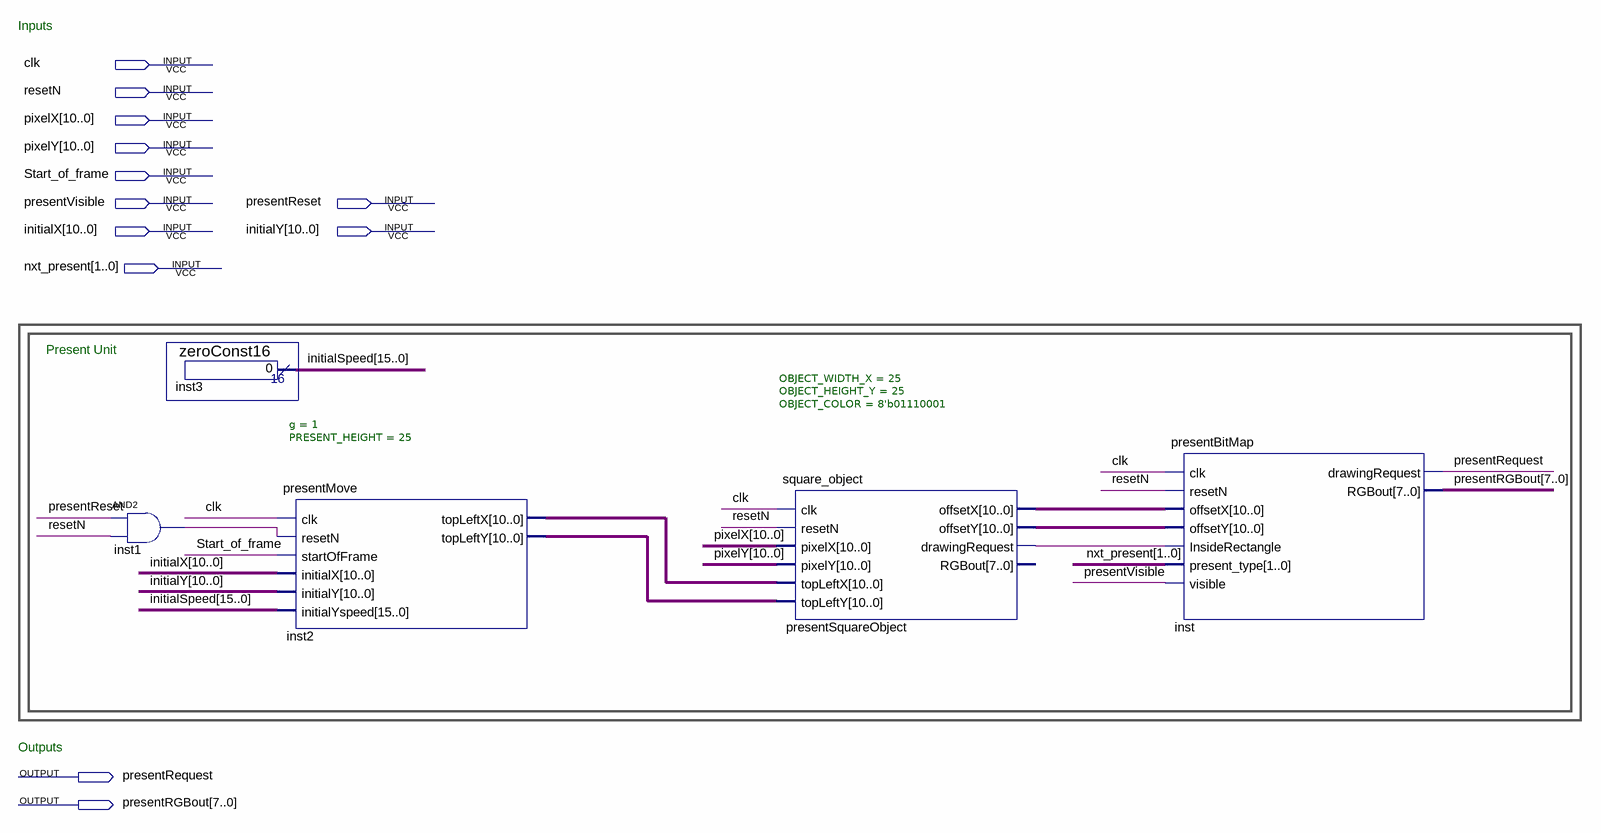
[diagram p0: schematic sheet]
// Quartus schematic present_top.bdf as structural Verilog: 5 symbols, 12 pins
module present_top (
  input  clk,
  input  resetN,
  input  [10:0] pixelX,
  input  [10:0] pixelY,
  input  Start_of_frame,
  input  presentVisible,
  input  presentReset,
  input  [10:0] initialX,
  input  [10:0] initialY,
  input  [1:0] nxt_present,
  output presentRequest,
  output [7:0] presentRGBout
);

  wire inst1_out, presentSquareObject_drawingrequest;
  wire [10:0] inst2_topleftx, inst2_toplefty, presentSquareObject_offsetx, presentSquareObject_offsety;
  wire [15:0] initialSpeed;

  and inst1 (inst1_out, presentReset, resetN);
  zeroConst16 inst3 (.result(initialSpeed));
  presentMove #(.g(1), .PRESENT_HEIGHT(25)) inst2 (
    .clk(clk), .resetN(inst1_out), .startOfFrame(Start_of_frame), .initialX(initialX), .initialY(initialY),
    .initialYspeed(initialSpeed), .topLeftX(inst2_topleftx), .topLeftY(inst2_toplefty));
  square_object #(.OBJECT_WIDTH_X(25), .OBJECT_HEIGHT_Y(25), .OBJECT_COLOR(8'b01110001)) presentSquareObject (
    .clk(clk), .resetN(resetN), .pixelX(pixelX), .pixelY(pixelY), .topLeftX(inst2_topleftx),
    .topLeftY(inst2_toplefty), .offsetX(presentSquareObject_offsetx), .offsetY(presentSquareObject_offsety),
    .drawingRequest(presentSquareObject_drawingrequest));  // open: RGBout
  presentBitMap inst (
    .clk(clk), .resetN(resetN), .offsetX(presentSquareObject_offsetx), .offsetY(presentSquareObject_offsety),
    .InsideRectangle(presentSquareObject_drawingrequest), .present_type(nxt_present),
    .visible(presentVisible), .drawingRequest(presentRequest), .RGBout(presentRGBout));

  // Notes on the sheet:
  //   Inputs
  //   Present Unit
  //   Outputs
endmodule
